# EAGLE schematic 5 LED Voltage Level Meter (EAGLE 6.2)
Voltage Level Meter with 5 LED for LiPo Akku with 22.2 V
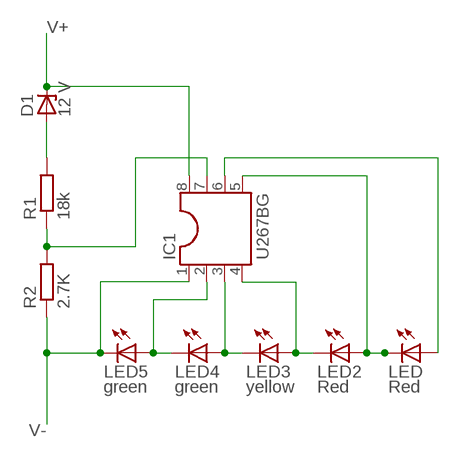
[diagram p0: schematic, sheet 1]

## Parts
D1  12 V  ZENER-DIODEF126-10  [F126Z10]
IC1  U267BG  DIL8  [DIL08]
LED  Red  TLLR4400  [LED3MM]
LED2  Red  TLLR4400  [LED3MM]
LED3  yellow  TLLY4400  [LED3MM]
LED4  green  TLLG4400  [LED3MM]
LED5  green  TLLG4400  [LED3MM]
R1  18k  R-EU_0207/12  [0207/12]
R2  2.7K  R-EU_0207/10  [0207/10]

## Nets
N$1: IC1.2 LED4.K(C) LED5.A
N$2: IC1.3 LED3.K(C) LED4.A
N$3: IC1.4 LED2.K(C) LED3.A
N$4: IC1.5 LED2.A LED.K(C)
N$5: IC1.6 LED.A
N$9: IC1.7 R1.1 R2.2
N$10: D1.A R1.2
V+: D1.C IC1.8
V-: IC1.1 LED5.K(C) R2.1

## Library data of the parts
D1 = diode:ZENER-DIODE: Z-Diode
IC1 = ic-package:DIL8: Dual In Line / Socket
LED LED2 = led:TLLR4400: Low Current (2mA) LED 3 mm Tinted Diffused Package color RED Source: Data sheet <http://www.farnell.com/datasheets/391100.pdf>; MF: VISHAY SEMICONDUCTOR; OC_FARNELL: 1612437
LED3 = led:TLLY4400: Low Current (2mA) LED 3 mm Tinted Diffused Package color YELLOW Source: Data sheet <http://www.farnell.com/datasheets/391098.pdf>; MF: VISHAY SEMICONDUCTOR; OC_FARNELL: 1612439
LED4 LED5 = led:TLLG4400: Low Current (2mA) LED 3 mm Tinted Diffused Package color GREEN Source: Data sheet <http://www.farnell.com/datasheets/391098.pdf>; MF: VISHAY SEMICONDUCTOR; OC_FARNELL: 1612435
R1 R2 = resistor:R-EU_: RESISTOR, European symbol